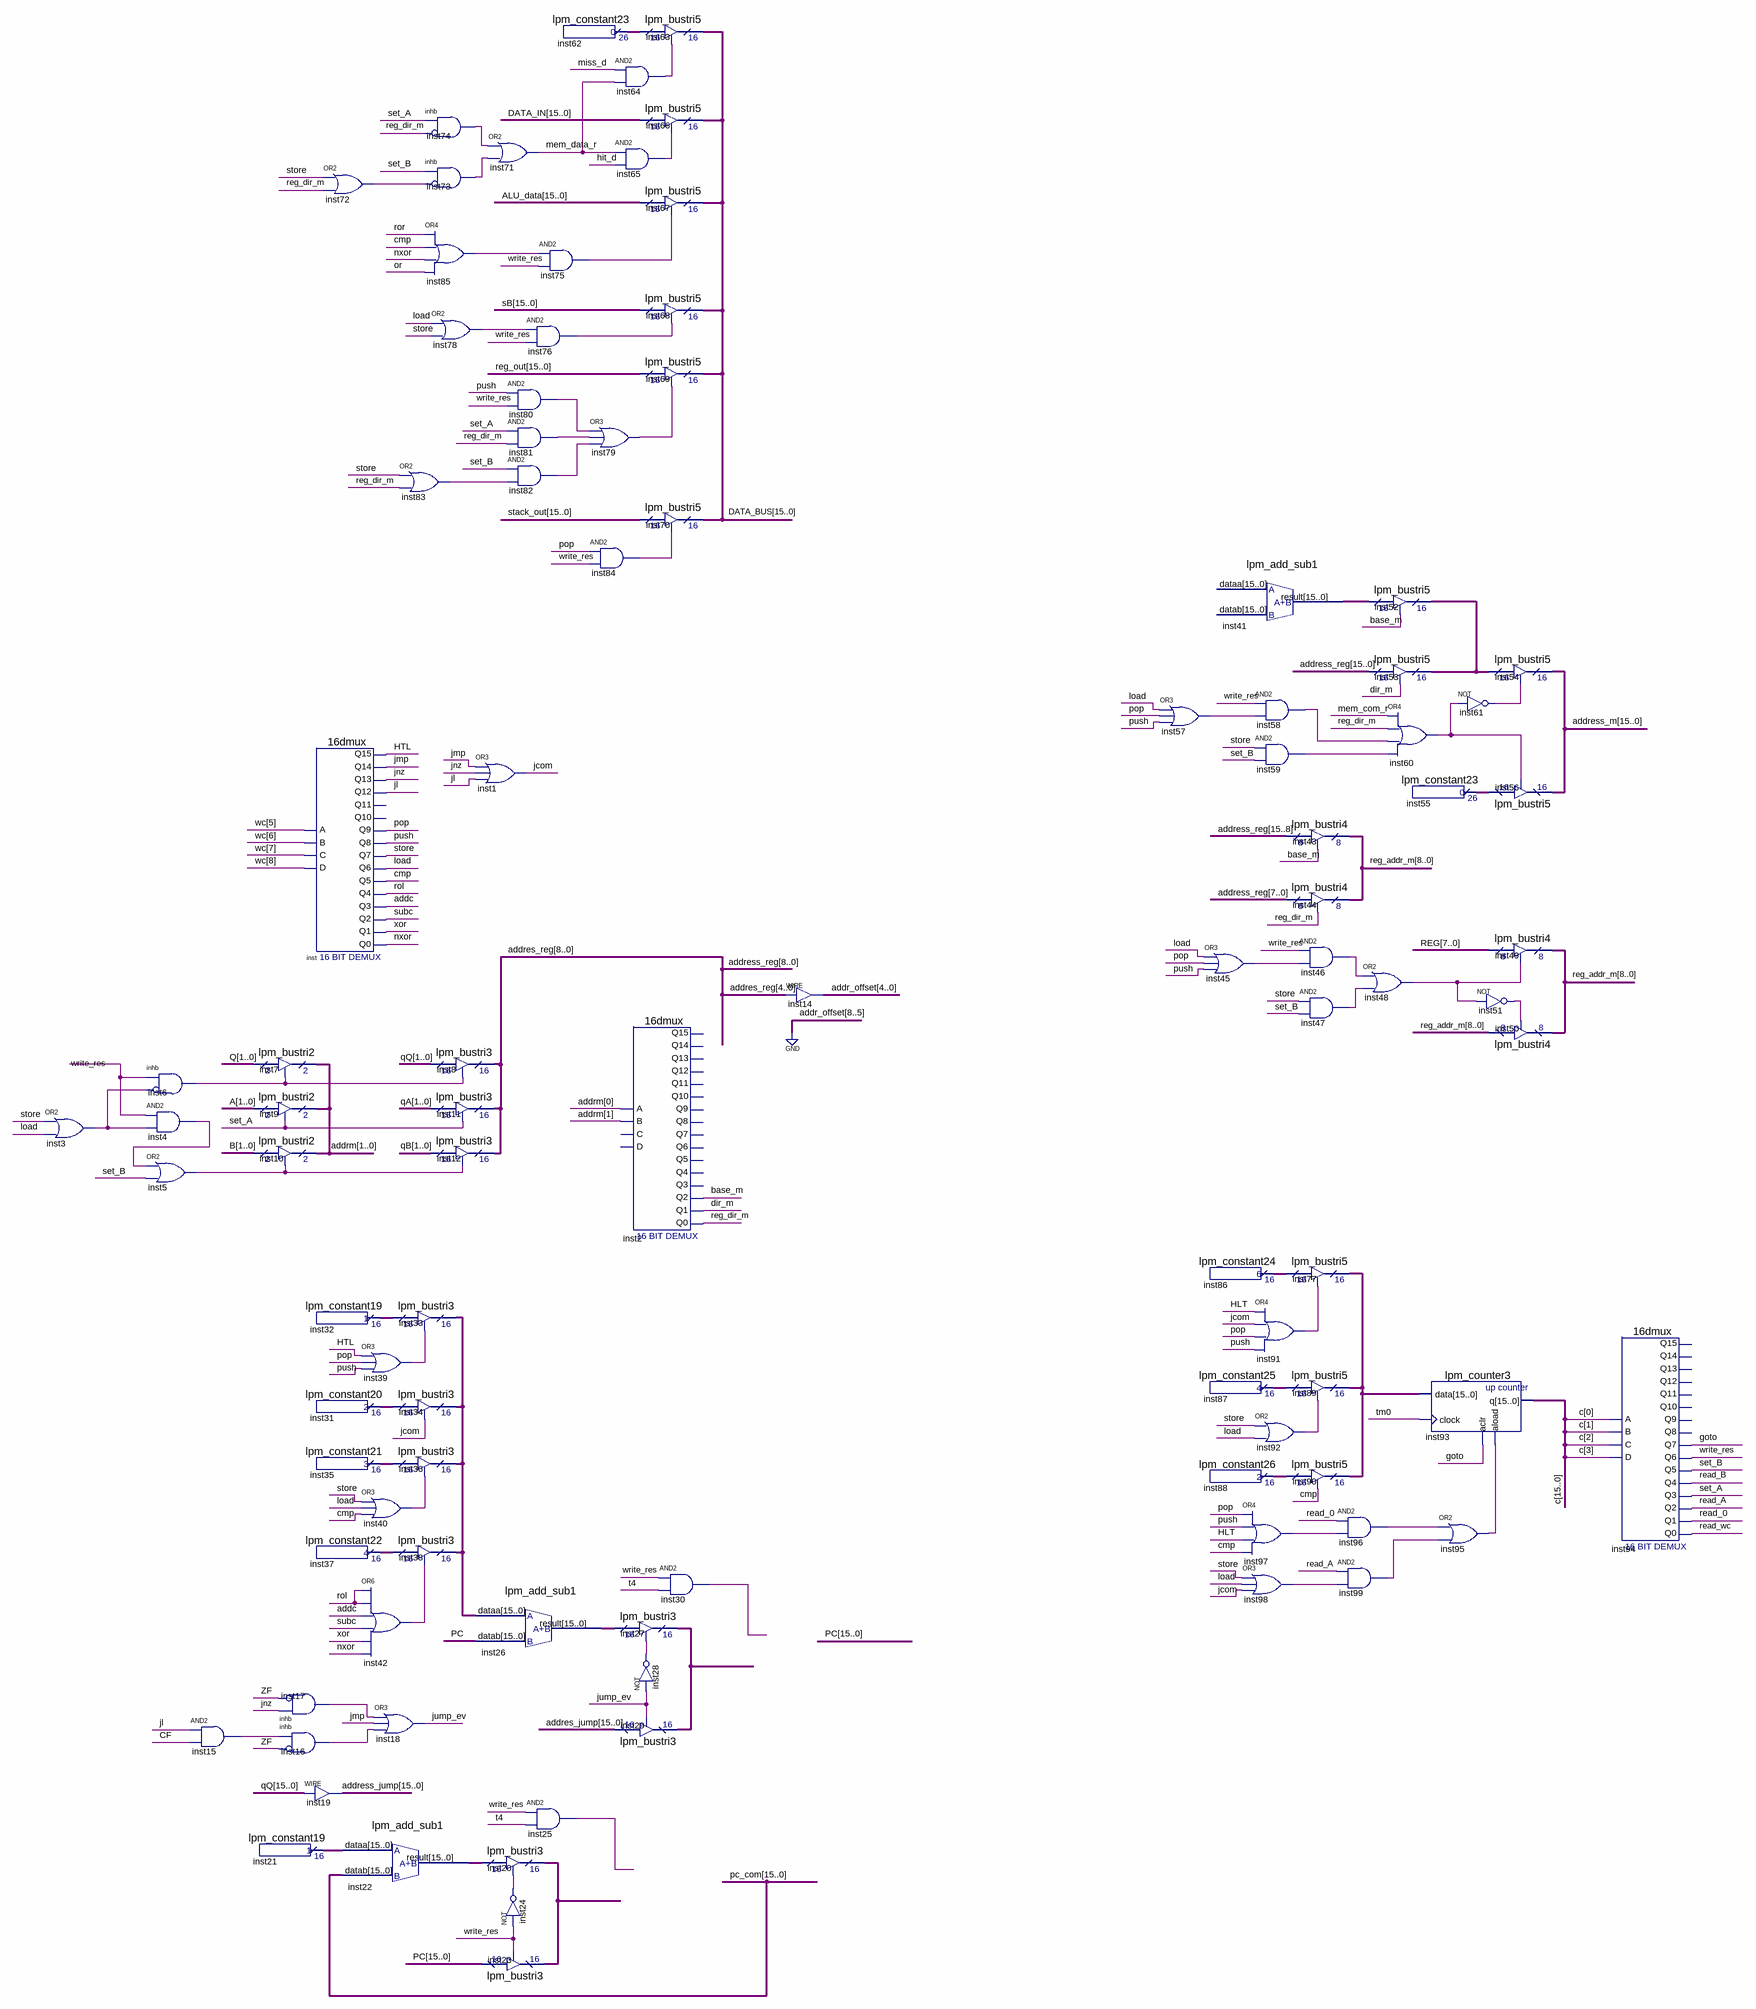
[diagram p0: schematic sheet]
// Quartus schematic cpu_unit.bdf as structural Verilog: 99 symbols, 0 pins
module cpu_unit (
);

  wire addc, base_m, CF, cmp, dir_m, goto, hit_d, HLT, HTL, inst3_out, inst4_out, inst5_out, inst6_1,
       inst15_out, inst16_1, inst17_1, inst24_out, inst25_out, inst28_out, inst30_out, inst39_out,
       inst40_out, inst42_out, inst45_out, inst46_out, inst47_out, inst48_out, inst51_out, inst57_out,
       inst58_out, inst59_out, inst60_out, inst61_out, inst64_out, inst65_out, inst72_out, inst73_1,
       inst74_1, inst75_out, inst76_out, inst78_out, inst79_out, inst80_out, inst81_out, inst82_out,
       inst83_out, inst84_out, inst85_out, inst91_out, inst92_out, inst95_out, inst96_out, inst97_out,
       inst98_out, inst99_out, jcom, jl, jmp, jnz, jump_ev, load, mem_com_r, mem_data_r, miss_d, nxor, \or ,
       PC_1bit, pop, push, read_0, read_A, read_B, read_wc, reg_dir_m, rol, ror, set_A, set_B, store, subc,
       t4, tm0, write_res, \xor , ZF;
  wire [1:0] A, addrm, B, Q, qA, qB;
  wire [4:0] addr_offset;
  wire [7:0] REG;
  wire [8:0] addres_reg, reg_addr_m;
  wire [8:5] wc;
  wire [15:0] addres_jump, address_jump, address_m, address_reg, ALU_data, c, DATA_BUS, DATA_IN,
       inst20_tridata, inst21_result, inst22_result, inst26_result, inst27_tridata, inst31_result,
       inst32_result, inst33_tridata, inst35_result, inst37_result, inst41_result, inst52_tridata,
       inst77_tridata, inst86_result, inst87_result, inst88_result, PC, pc_com, qQ, reg_out, sB, stack_out;
  wire [25:0] inst55_result, inst62_result;

  or inst3 (inst3_out, store, load);
  inhb inst6 (.\2 (write_res), .\3 (inst3_out), .\1 (inst6_1));
  and inst4 (inst4_out, write_res, inst3_out);
  or inst5 (inst5_out, inst4_out, set_B);
  and inst15 (inst15_out, jl, CF);
  lpm_bustri2 inst7 (.enabledt(inst6_1), .data(Q), .tridata(addrm));
  lpm_bustri2 inst9 (.enabledt(set_A), .data(A), .tridata(addrm));
  lpm_bustri2 inst10 (.enabledt(inst5_out), .data(B), .tridata(addrm));
  lpm_constant19 inst21 (.result(inst21_result));
  or inst72 (inst72_out, store, reg_dir_m);
  \16dmux  inst (
    .C(wc[7]), .B(wc[6]), .A(wc[5]), .D(wc[8]), .Q12(jl), .Q13(jnz), .Q9(pop), .Q7(store), .Q8(push),
    .Q4(rol), .Q5(cmp), .Q6(load), .Q2(subc), .Q3(addc), .Q14(jmp), .Q15(HTL), .Q0(nxor), .Q1(\xor ));  // open: Q11, Q10
  lpm_constant19 inst32 (.result(inst32_result));
  lpm_constant20 inst31 (.result(inst31_result));
  lpm_constant21 inst35 (.result(inst35_result));
  lpm_constant22 inst37 (.result(inst37_result));
  inhb inst17 (.\2 (jnz), .\3 (ZF), .\1 (inst17_1));
  inhb inst16 (.\2 (inst15_out), .\3 (ZF), .\1 (inst16_1));
  assign address_jump = qQ;  // WIRE inst19
  or inst39 (inst39_out, HTL, pop, push);
  or inst40 (inst40_out, store, load, cmp);
  or inst42 (inst42_out, rol, rol, addc, subc, \xor , nxor);
  or inst18 (jump_ev, inst17_1, jmp, inst16_1);
  lpm_add_sub1 inst22 (.dataa(inst21_result), .datab(pc_com), .result(inst22_result));
  inhb inst74 (.\2 (set_A), .\3 (reg_dir_m), .\1 (inst74_1));
  inhb inst73 (.\2 (set_B), .\3 (inst72_out), .\1 (inst73_1));
  or inst85 (inst85_out, ror, cmp, nxor, \or );
  or inst83 (inst83_out, store, reg_dir_m);
  lpm_bustri3 inst33 (.enabledt(inst39_out), .data(inst32_result), .tridata(inst33_tridata));
  lpm_bustri3 inst34 (.enabledt(jcom), .data(inst31_result), .tridata(inst33_tridata));
  lpm_bustri3 inst36 (.enabledt(inst40_out), .data(inst35_result), .tridata(inst33_tridata));
  lpm_bustri3 inst38 (.enabledt(inst42_out), .data(inst37_result), .tridata(inst33_tridata));
  or inst78 (inst78_out, load, store);
  or inst1 (jcom, jmp, jnz, jl);
  lpm_bustri3 inst8 (.enabledt(inst6_1), .data(qQ[1:0]), .tridata(addres_reg));
  lpm_bustri3 inst11 (.enabledt(set_A), .data(qA), .tridata(addres_reg));
  lpm_bustri3 inst12 (.enabledt(inst5_out), .data(qB), .tridata(addres_reg));
  lpm_add_sub1 inst26 (.dataa(inst33_tridata), .datab({16{PC_1bit}}), .result(inst26_result));
  or inst71 (mem_data_r, inst74_1, inst73_1);
  and inst76 (inst76_out, inst78_out, write_res);
  and inst80 (inst80_out, push, write_res);
  and inst81 (inst81_out, set_A, reg_dir_m);
  and inst82 (inst82_out, set_B, inst83_out);
  and inst25 (inst25_out, write_res, t4);
  lpm_bustri3 inst20 (.enabledt(inst24_out), .data(inst22_result), .tridata(inst20_tridata));
  not inst24 (inst24_out, write_res);
  lpm_bustri3 inst23 (.enabledt(write_res), .data(PC), .tridata(inst20_tridata));
  lpm_constant23 inst62 (.result(inst62_result));
  and inst75 (inst75_out, inst85_out, write_res);
  and inst64 (inst64_out, miss_d, mem_data_r);
  and inst65 (inst65_out, mem_data_r, hit_d);
  or inst79 (inst79_out, inst80_out, inst81_out, inst82_out);
  and inst84 (inst84_out, pop, write_res);
  \16dmux  inst2 (
    .B(addrm[1]), .A(addrm[0]), .Q2(base_m), .Q0(reg_dir_m), .Q1(dir_m));  // open: C, D, Q12, Q13, Q11, Q9, Q10, Q7, Q8, Q4, Q5, Q6, Q3, Q14, Q15
  lpm_bustri3 inst27 (.enabledt(inst28_out), .data(inst26_result), .tridata(inst27_tridata));
  lpm_bustri3 inst29 (.enabledt(jump_ev), .data(addres_jump), .tridata(inst27_tridata));
  lpm_bustri5 inst63 (.enabledt(inst64_out), .data(inst62_result), .tridata(DATA_BUS));
  lpm_bustri5 inst66 (.enabledt(inst65_out), .data(DATA_IN), .tridata(DATA_BUS));
  lpm_bustri5 inst67 (.enabledt(inst75_out), .data(ALU_data), .tridata(DATA_BUS));
  lpm_bustri5 inst68 (.enabledt(inst76_out), .data(sB), .tridata(DATA_BUS));
  lpm_bustri5 inst69 (.enabledt(inst79_out), .data(reg_out), .tridata(DATA_BUS));
  lpm_bustri5 inst70 (.enabledt(inst84_out), .data(stack_out), .tridata(DATA_BUS));
  and inst30 (inst30_out, write_res, t4);
  not inst28 (inst28_out, jump_ev);
  assign addr_offset = addres_reg[4:0];  // WIRE inst14
  or inst57 (inst57_out, load, pop, push);
  lpm_add_sub1 inst41 (.result(inst41_result));  // open: dataa, datab
  or inst45 (inst45_out, load, pop, push);
  lpm_constant24 inst86 (.result(inst86_result));
  lpm_constant25 inst87 (.result(inst87_result));
  lpm_constant26 inst88 (.result(inst88_result));
  and inst58 (inst58_out, write_res, inst57_out);
  and inst59 (inst59_out, store, set_B);
  lpm_bustri4 inst43 (.enabledt(base_m), .data(address_reg[15:8]), .tridata(reg_addr_m));
  lpm_bustri4 inst44 (.enabledt(reg_dir_m), .data(address_reg[7:0]), .tridata(reg_addr_m));
  lpm_bustri5 inst77 (.enabledt(inst91_out), .data(inst86_result), .tridata(inst77_tridata));
  or inst91 (inst91_out, HLT, jcom, pop, push);
  lpm_bustri5 inst89 (.enabledt(inst92_out), .data(inst87_result), .tridata(inst77_tridata));
  or inst92 (inst92_out, store, load);
  lpm_bustri5 inst90 (.enabledt(cmp), .data(inst88_result), .tridata(inst77_tridata));
  or inst97 (inst97_out, pop, push, HLT, cmp);
  or inst98 (inst98_out, store, load, jcom);
  and inst46 (inst46_out, write_res, inst45_out);
  and inst47 (inst47_out, store, set_B);
  and inst96 (inst96_out, read_0, inst97_out);
  and inst99 (inst99_out, read_A, inst98_out);
  lpm_bustri5 inst52 (.enabledt(base_m), .data(inst41_result), .tridata(inst52_tridata));
  lpm_bustri5 inst53 (.enabledt(dir_m), .data(address_reg), .tridata(inst52_tridata));
  or inst60 (inst60_out, mem_com_r, reg_dir_m, inst58_out, inst59_out);
  or inst48 (inst48_out, inst46_out, inst47_out);
  lpm_constant23 inst55 (.result(inst55_result));
  lpm_counter3 inst93 (.data(inst77_tridata), .clock(tm0), .aclr(goto), .aload(inst95_out), .q(c));
  or inst95 (inst95_out, inst96_out, inst99_out);
  lpm_bustri5 inst54 (.enabledt(inst61_out), .data(inst52_tridata), .tridata(address_m));
  not inst61 (inst61_out, inst60_out);
  lpm_bustri5 inst56 (.enabledt(inst60_out), .data(inst55_result), .tridata(address_m));
  lpm_bustri4 inst49 (.enabledt(inst48_out), .data(REG), .tridata(reg_addr_m));
  not inst51 (inst51_out, inst48_out);
  lpm_bustri4 inst50 (.enabledt(inst51_out), .data(reg_addr_m), .tridata(reg_addr_m));
  \16dmux  inst94 (
    .C(c[2]), .B(c[1]), .A(c[0]), .D(c[3]), .Q7(goto), .Q4(read_B), .Q5(set_B), .Q6(write_res), .Q2(read_A),
    .Q3(set_A), .Q0(read_wc), .Q1(read_0));  // open: Q12, Q13, Q11, Q9, Q10, Q8, Q14, Q15
endmodule
